# Altium schematic sheet Top.SchDoc
size A4; SheetNumber: 1; SheetTotal: 6
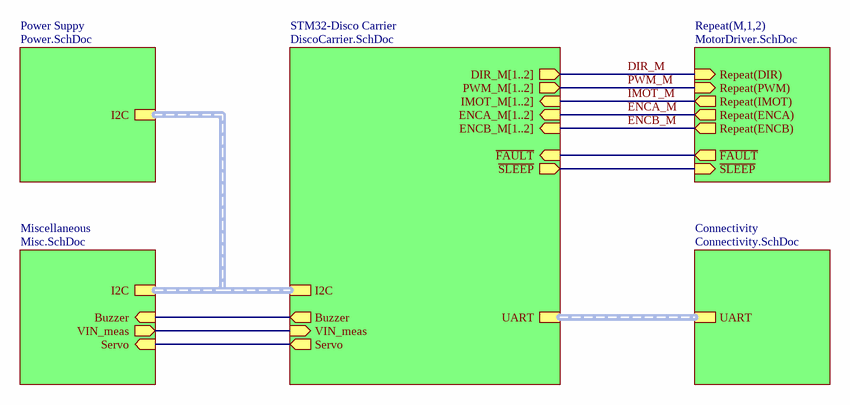
[diagram p0: Top.SchDoc]

## Sub-sheets
Connectivity = Connectivity.SchDoc: UART (harness UART)
Miscellaneous = Misc.SchDoc: Buzzer (in), I2C (harness I2C), VIN_meas (out), Servo (in)
Power Suppy = Power.SchDoc: I2C (harness I2C)
Repeat(M,1,2) = MotorDriver.SchDoc: ~{FAULT} (out), ~{SLEEP} (in), Repeat(DIR) (in), Repeat(PWM) (in), Repeat(IMOT) (out), Repeat(ENCA) (out), Repeat(ENCB) (out)
STM32-Disco Carrier = DiscoCarrier.SchDoc: ~{FAULT} (in), ~{SLEEP} (out), DIR_M[1..2] (out), PWM_M[1..2] (out), IMOT_M[1..2] (in), ENCA_M[1..2] (in), ENCB_M[1..2] (in), UART (harness UART), Buzzer (out), I2C (harness I2C), VIN_meas (in), Servo (out)

## Nets
DIR_M: sheet Repeat(M,1,2)/Repeat(DIR)
ENCA_M: sheet Repeat(M,1,2)/Repeat(ENCA)
ENCB_M: sheet Repeat(M,1,2)/Repeat(ENCB)
IMOT_M: sheet Repeat(M,1,2)/Repeat(IMOT)
PWM_M: sheet Repeat(M,1,2)/Repeat(PWM)
(unnamed): sheet STM32-Disco Carrier/~{FAULT}, sheet Repeat(M,1,2)/~{FAULT}
(unnamed): sheet STM32-Disco Carrier/~{SLEEP}, sheet Repeat(M,1,2)/~{SLEEP}
(unnamed): sheet STM32-Disco Carrier/Buzzer, sheet Miscellaneous/Buzzer
(unnamed): sheet STM32-Disco Carrier/VIN_meas, sheet Miscellaneous/VIN_meas
(unnamed): sheet STM32-Disco Carrier/Servo, sheet Miscellaneous/Servo

## Buses and harness runs
harness sheet Connectivity/UART = sheet STM32-Disco Carrier/UART
harness sheet Miscellaneous/I2C = sheet Power Suppy/I2C = sheet STM32-Disco Carrier/I2C

## Notes on the sheet
- Project:
- Board:
- Title:
- Size:
- Sheet:
- A4
- of
- Drawn by:
- Revision:
- Date:
- Variant:
- Source Engineers GmbH | CH-3012 Bern
- File: